# EAGLE design detec (EAGLE 4.11)
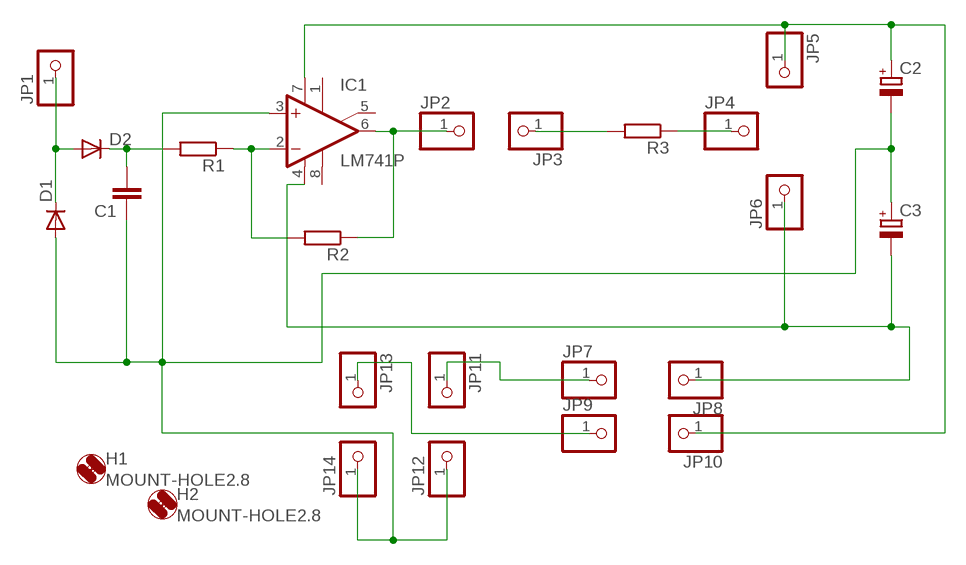
[diagram p0: schematic, sheet 1]

## Parts
C1  C-EU050-025X075  [C050-025X075]
C2  CPOL-EUE5-5  [E5-5]
C3  CPOL-EUE5-5  [E5-5]
D1  DIODE-C1702-05  [C1702-05]
D2  DIODE-C1702-05  [C1702-05]
H1  MOUNT-HOLE2.8  [2,8]
H2  MOUNT-HOLE2.8  [2,8]
IC1  LM741P  [DIL08]
JP1  PINHD-1X1  [1X01]
JP2  PINHD-1X1  [1X01]
JP3  PINHD-1X1  [1X01]
JP4  PINHD-1X1  [1X01]
JP5  PINHD-1X1  [1X01]
JP6  PINHD-1X1  [1X01]
JP7  PINHD-1X1  [1X01]
JP8  PINHD-1X1  [1X01]
JP9  PINHD-1X1  [1X01]
JP10  PINHD-1X1  [1X01]
JP11  PINHD-1X1  [1X01]
JP12  PINHD-1X1  [1X01]
JP13  PINHD-1X1  [1X01]
JP14  PINHD-1X1  [1X01]
R1  R-EU_0207/5V  [0207/5V]
R2  R-EU_0207/5V  [0207/5V]
R3  R-EU_0207/5V  [0207/5V]

## Nets
N$1: D1.C D2.A JP1.1
N$2: C1.2 D2.C R1.2
N$3: IC1.2(-IN) R1.1 R2.2
N$4: IC1.6(OUT) JP2.1 R2.1
N$5: JP3.1 R3.2
N$6: JP4.1 R3.1
N$7: C2.+ IC1.7(V+) JP5.1 JP10.1
N$8: C3.- IC1.4(V-) JP6.1 JP8.1
N$11: JP7.1 JP11.1
N$12: C1.1 C2.- C3.+ D1.A IC1.3(+IN) JP12.1 JP14.1
N$13: JP9.1 JP13.1
Unconnected: IC1.1(ON1) IC1.5(ON2) IC1.8(OPT)

## Library data of the parts
C1 = rcl:C-EU: CAPACITOR, European symbol
C2 C3 = rcl:CPOL-EU: POLARIZED CAPACITOR, European symbol
D1 D2 = diode:DIODE-: DIODE
H1 H2 = holes:MOUNT-HOLE: MOUNTING HOLE with drill center marker
IC1 = linear:*741: OP AMP
JP1-JP14 = pinhead:PINHD-1X1: PIN HEADER
R1-R3 = rcl:R-EU_: RESISTOR, European symbol

## Board
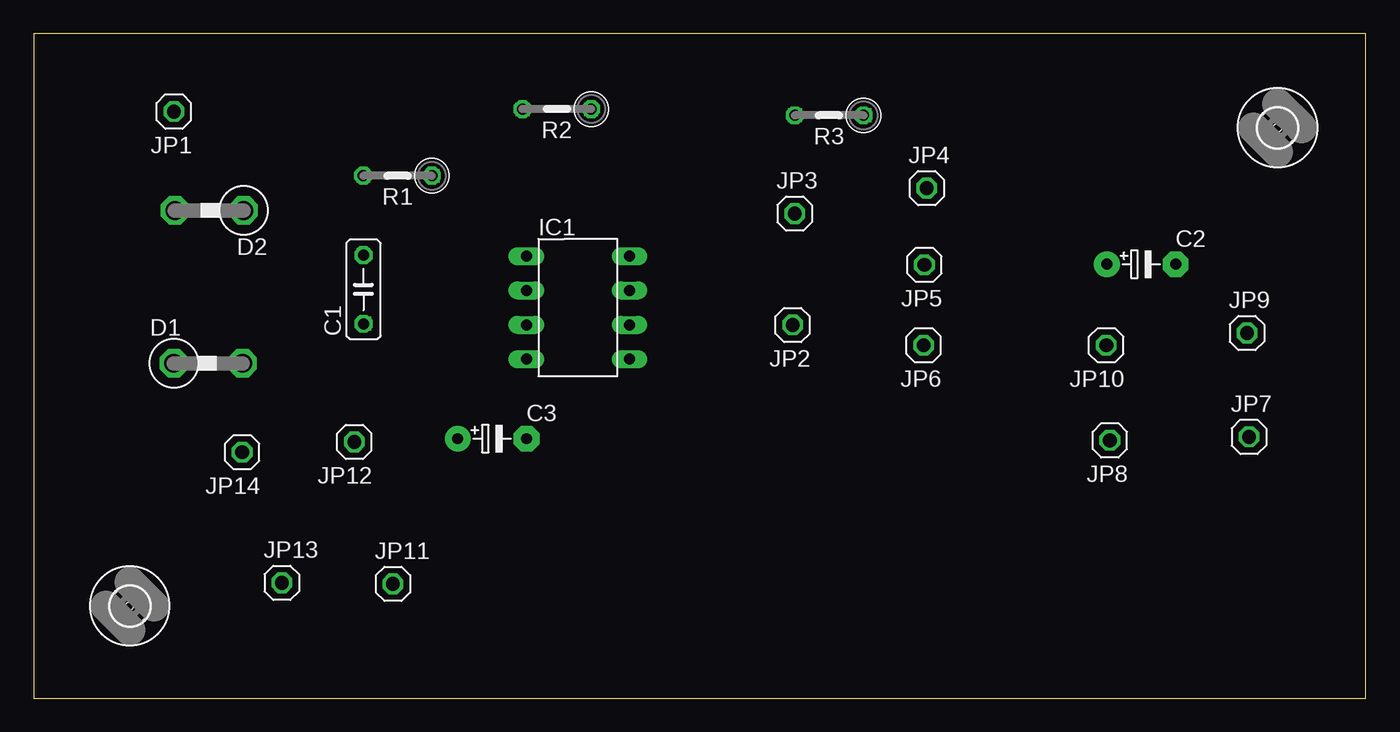
[diagram p1: board, top side]
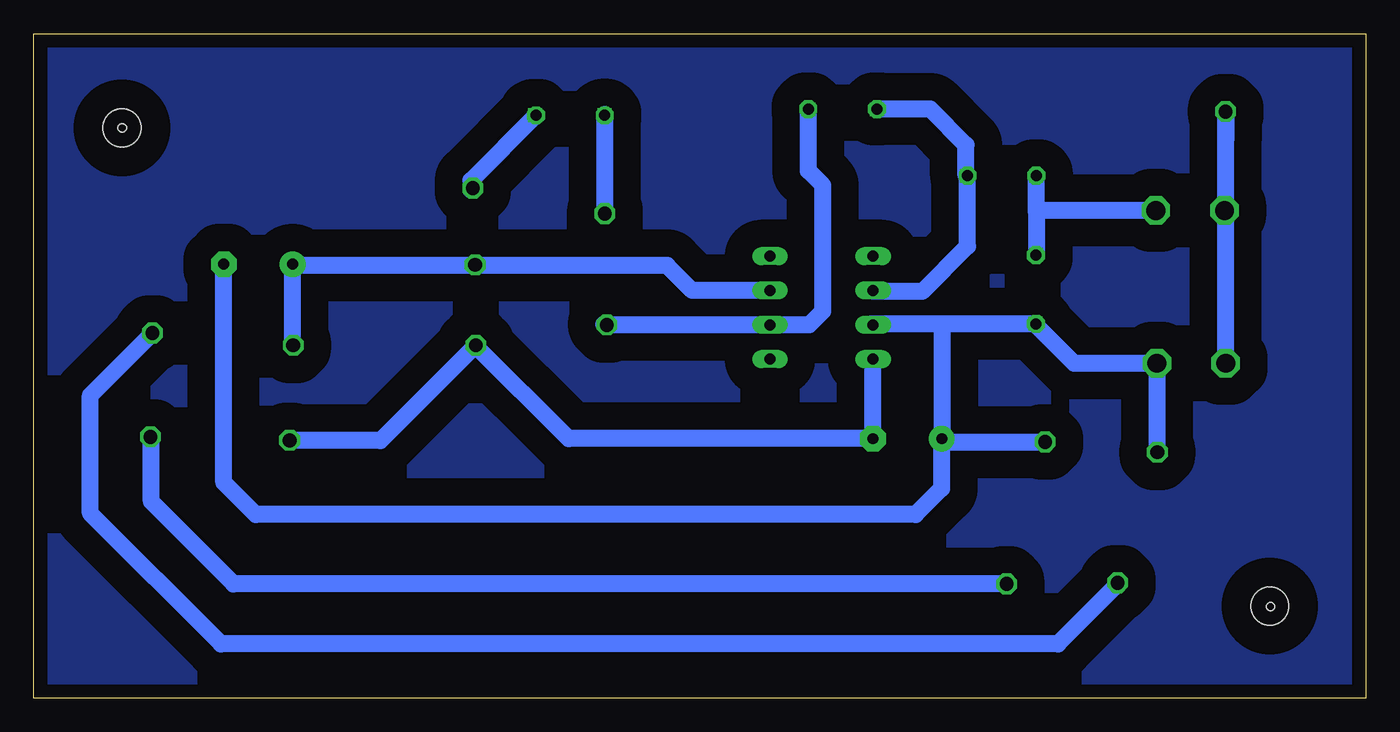
[diagram p2: board, bottom side, seen from below]

Size 98.49 x 49.14 mm. Coordinates in mm from the lower left corner, seen from the top.
Outline: 0,0 98.49,0 98.49,49.14 0,49.14 0,0
Copper layers 16: Bottom 0.035mm
Design rules "default": minimum track width 10mil, minimum drill 24mil, track to track 80mil, track to pad 80mil, pad to pad 80mil, via to via 80mil, smd to smd 80mil, copper to edge 40mil, drill to drill 8mil, minimum pad ring 10mil, minimum via ring 8mil, stop-mask expansion 4mil, vias tented up to drill 0mil, thermal gap 10mil
Holes 0.61 mm at 7.05,6.78 91.96,42.18

### Footprints (pad centres in the part's own frame; a part is rotated, then mirrored left to right if it is on the bottom)
C050-025X075 = drill 0.813 octagon: 1 -2.54,0; 2 2.54,0
E5-5 = drill 0.813 pad 1.905 round: + -2.54,0 | drill 0.813 pad 1.905 octagon: - 2.54,0
C1702-05 = drill 1.397 octagon: A 2.54,0; C -2.54,0
2,8 = hole 2.8: 0,0
DIL08 = drill 0.813 long: 1 -3.81,-3.81; 2 -1.27,-3.81; 3 1.27,-3.81; 4 3.81,-3.81; 5 3.81,3.81; 6 1.27,3.81; 7 -1.27,3.81; 8 -3.81,3.81
1X01 = drill 1.016 octagon: 1 0,0
0207/5V = drill 0.813 octagon: 1 -2.54,0; 2 2.54,0

### Placement (x,y rotation side)
C1  24.38,30.23 90 top
C2  81.9,32.1 0 top
C3  33.9,19.19 0 top
D1  12.9,24.77 0 top
D2  12.97,36.08 180 top
H1  91.97,42.19 0 top
H2  7.1,6.81 0 top
IC1  40.24,28.89 270 top
JP1  10.36,43.39 180 top
JP2  56.11,27.6 180 top
JP3  56.26,35.84 0 top
JP4  66.02,37.73 0 top
JP5  65.86,32.05 180 top
JP6  65.8,26.11 180 top
JP7  89.86,19.33 0 top
JP8  79.57,19.07 180 top
JP9  89.71,27.01 0 top
JP10  79.31,26.1 180 top
JP11  26.56,8.45 0 top
JP12  23.7,18.95 180 top
JP13  18.34,8.53 0 top
JP14  15.41,18.19 180 top
R1  26.9,38.65 180 top
R2  38.68,43.57 180 top
R3  58.81,43.11 180 top

### Tracks (layer width: path | path; a pad name or v marks a point on that pad's centre or on a via)
N$1
  Bottom 1.27: 10.35,41.24 JP1.1 10.36,36.11 10.35,36.1 10.37,36.08 D2.A 10.44,36.04 10.36,35.96 D1.C
N$2
  Bottom 1.27: 24.45,32.77 24.45,32.79 | 24.45,32.77 C1.2 24.35,32.79 24.36,32.79 24.36,36.02 | 24.45,32.77 | 24.36,36.02 R1.2 | 24.36,36.02 24.35,36.02 24.3,36.08 D2.C
N$3
  Bottom 1.27: IC1.2 36.43,30.11 36.4,30.08 32.79,30.08 29.44,33.42 R1.1 29.54,38.65 29.55,38.66 29.55,40.92 32.2,43.57 R2.2
N$4
  Bottom 1.27: 56.3,27.62 56.29,27.61 JP2.1 | 56.3,27.62 IC1.6 41.15,27.62 40.15,28.62 40.15,37.94 41.21,39.01 41.21,43.45 41.22,43.46 R2.1 | 56.3,27.62 56.34,27.65
N$5
  Bottom 1.27: 56.27,43.16 56.28,43.18 | 56.27,43.16 R3.2 | JP3.1 56.26,43.16 56.27,43.16
N$6
  Bottom 1.27: JP4.1 66.15,37.6 66.17,37.6 66.17,38.29 R3.1
N$7
  Bottom 1.27: IC1.7 49.81,30.16 51.66,32.01 65.79,32.01 65.86,32.07 | 65.86,32.07 65.9,32.12 66.01,32.01 79.38,32.01 79.38,32.07 C2.+ 79.37,32.12 79.38,32.12 79.38,26.18 JP10.1 | 65.86,32.07 JP5.1
N$8  (via drill 0.61)
  Bottom 1.27: 36.47,19.19 36.6,19.06 | 36.47,19.19 C3.- 58.94,19.19 65.85,26.1 65.84,26.11 v65.81,26.11 JP6.1 72.85,19.06 79.58,19.06 | IC1.4 36.43,19.23 36.47,19.19 | 79.58,19.06 79.65,19.06 | 79.58,19.06 JP8.1
N$9
  pour Bottom: 0.63,0.47 0.63,48.47 97.63,48.47 97.63,0.47
N$10  (via drill 0.61)
  other vias: 10.36,43.4
N$11
  Bottom 1.27: JP11.1 83.71,8.45 89.81,14.54 89.81,19.27 JP7.1
N$12
  Bottom 1.27: 36.54,27.62 36.54,27.61 | 36.54,27.62 IC1.3 | 31.43,27.69 C1.1 24.44,27.69 24.45,27.67 21.56,24.77 D1.A 15.46,24.75 15.41,24.7 JP14.1 | 31.43,27.69 36.54,27.69 36.54,27.62 | 31.43,27.69 31.43,27.67 31.36,27.6 C3.+ 31.36,18.95 | C2.- 84.44,15.94 82.07,13.58 33.29,13.58 31.36,15.51 31.36,18.95 | 31.46,18.95 31.47,18.95 | 31.36,18.95 31.46,18.95 | JP12.1 31.46,18.95
N$13
  Bottom 1.27: JP9.1 94.32,22.4 94.32,13.68 84.65,4.01 22.76,4.01 18.34,8.44 JP13.1
N$14  (via drill 0.61)
  other vias: 10.47,36.06
N$15  (via drill 0.61)
  other vias: 15.55,36.01
N$16  (via drill 0.61)
  other vias: 10.31,24.77
N$17  (via drill 0.61)
  other vias: 15.55,24.72
N$18  (via drill 0.61)
  other vias: 24.42,27.71
N$19  (via drill 0.61)
  other vias: 24.37,32.8
N$20  (via drill 0.61)
  other vias: 24.37,38.63
N$21  (via drill 0.61)
  other vias: 29.5,38.63
N$22  (via drill 0.61)
  other vias: 36.13,43.56
N$23  (via drill 0.61)
  other vias: 41.21,43.56
N$24  (via drill 0.61)
  other vias: 23.68,18.94
N$25  (via drill 0.61)
  other vias: 15.39,18.24
N$26  (via drill 0.61)
  other vias: 31.38,19.2
N$27  (via drill 0.61)
  other vias: 36.46,19.15
N$28  (via drill 0.61)
  other vias: 36.46,32.74
N$29  (via drill 0.61)
  other vias: 36.46,30.18
N$30  (via drill 0.61)
  other vias: 36.46,27.66
N$31  (via drill 0.61)
  other vias: 36.46,25.09
N$32  (via drill 0.61)
  other vias: 44.05,25.04
N$33  (via drill 0.61)
  other vias: 44.1,27.61
N$34  (via drill 0.61)
  other vias: 44.1,30.18
N$35  (via drill 0.61)
  other vias: 44.1,32.69
N$36  (via drill 0.61)
  other vias: 26.56,8.45
N$37  (via drill 0.61)
  other vias: 18.33,8.55
N$38  (via drill 0.61)
  other vias: 89.87,19.31
N$39  (via drill 0.61)
  other vias: 89.71,27.02
N$40  (via drill 0.61)
  other vias: 79.55,19.04
N$41  (via drill 0.61)
  other vias: 79.28,26.11
N$42  (via drill 0.61)
  other vias: 79.39,32.1
N$43  (via drill 0.61)
  other vias: 84.47,32.1
N$44  (via drill 0.61)
  other vias: 65.86,32.05
N$45  (via drill 0.61)
  other vias: 56.24,35.85
N$46  (via drill 0.61)
  other vias: 56.13,27.61
N$47  (via drill 0.61)
  other vias: 66.02,37.72
N$48  (via drill 0.61)
  other vias: 61.43,43.13
N$49  (via drill 0.61)
  other vias: 56.29,43.13